# Altium schematic sheet bmsMaster_cover.SchDoc
size A; SheetNumber: 1; SheetTotal: 9
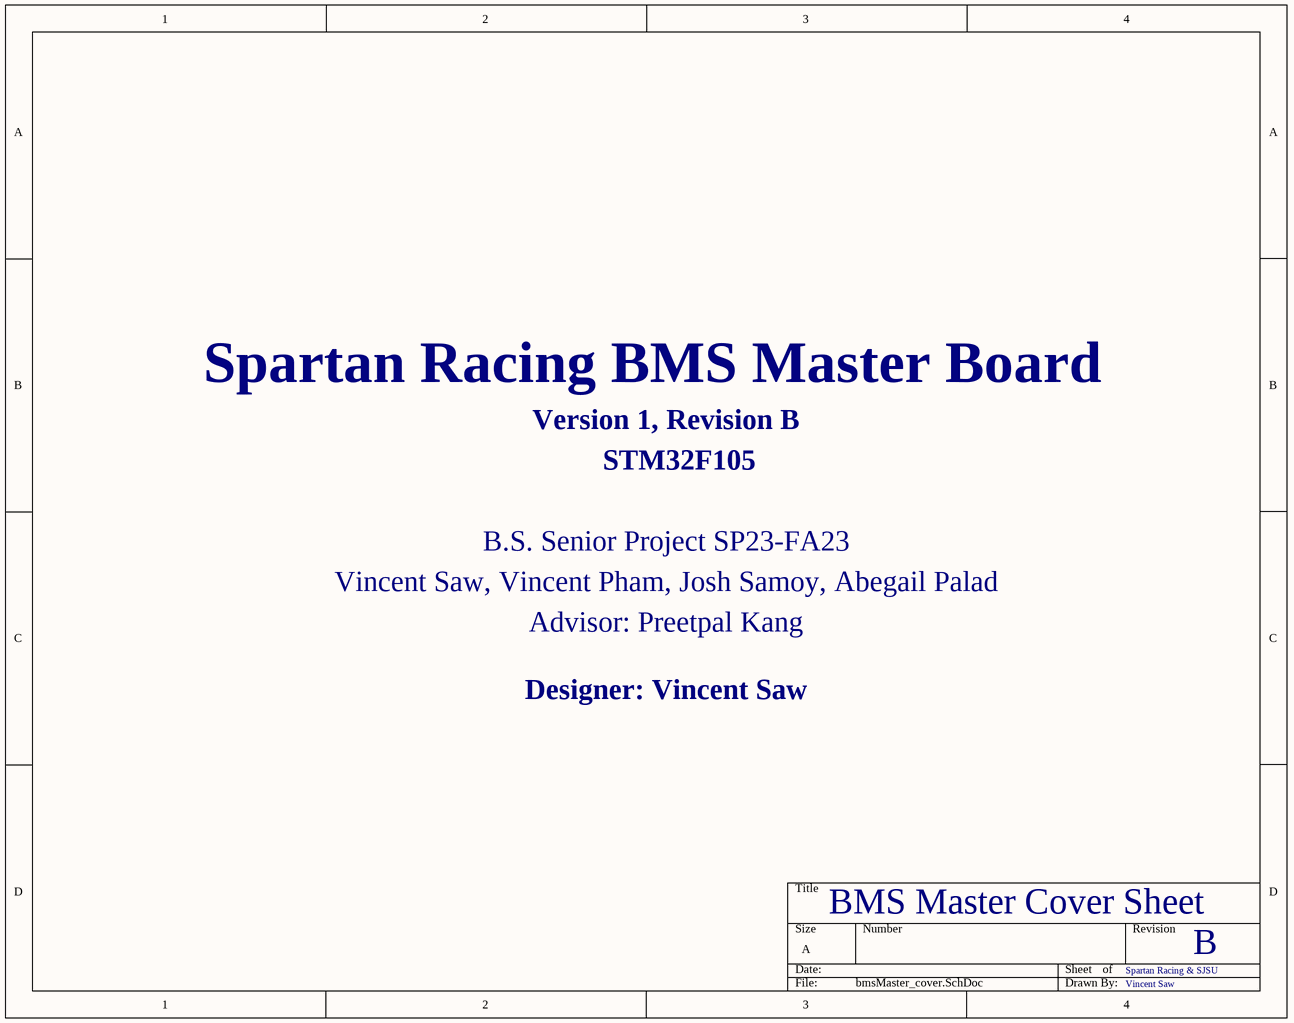
[diagram p0: bmsMaster_cover.SchDoc]

## Notes on the sheet
- Spartan Racing BMS Master Board
- Version 1, Revision B
- STM32F105
- B.S. Senior Project SP23-FA23
- Vincent Saw, Vincent Pham, Josh Samoy, Abegail Palad
- Advisor: Preetpal Kang
- Designer: Vincent Saw
- BMS Master Cover Sheet
- Spartan Racing & SJSU
- B
- Vincent Saw